# EAGLE schematic Unit C North Door TinkerAccess (EAGLE 9.7.0)
DRAWING_TITLE: Unit C North Door TinkerAccess

## Sheet 1 of 3
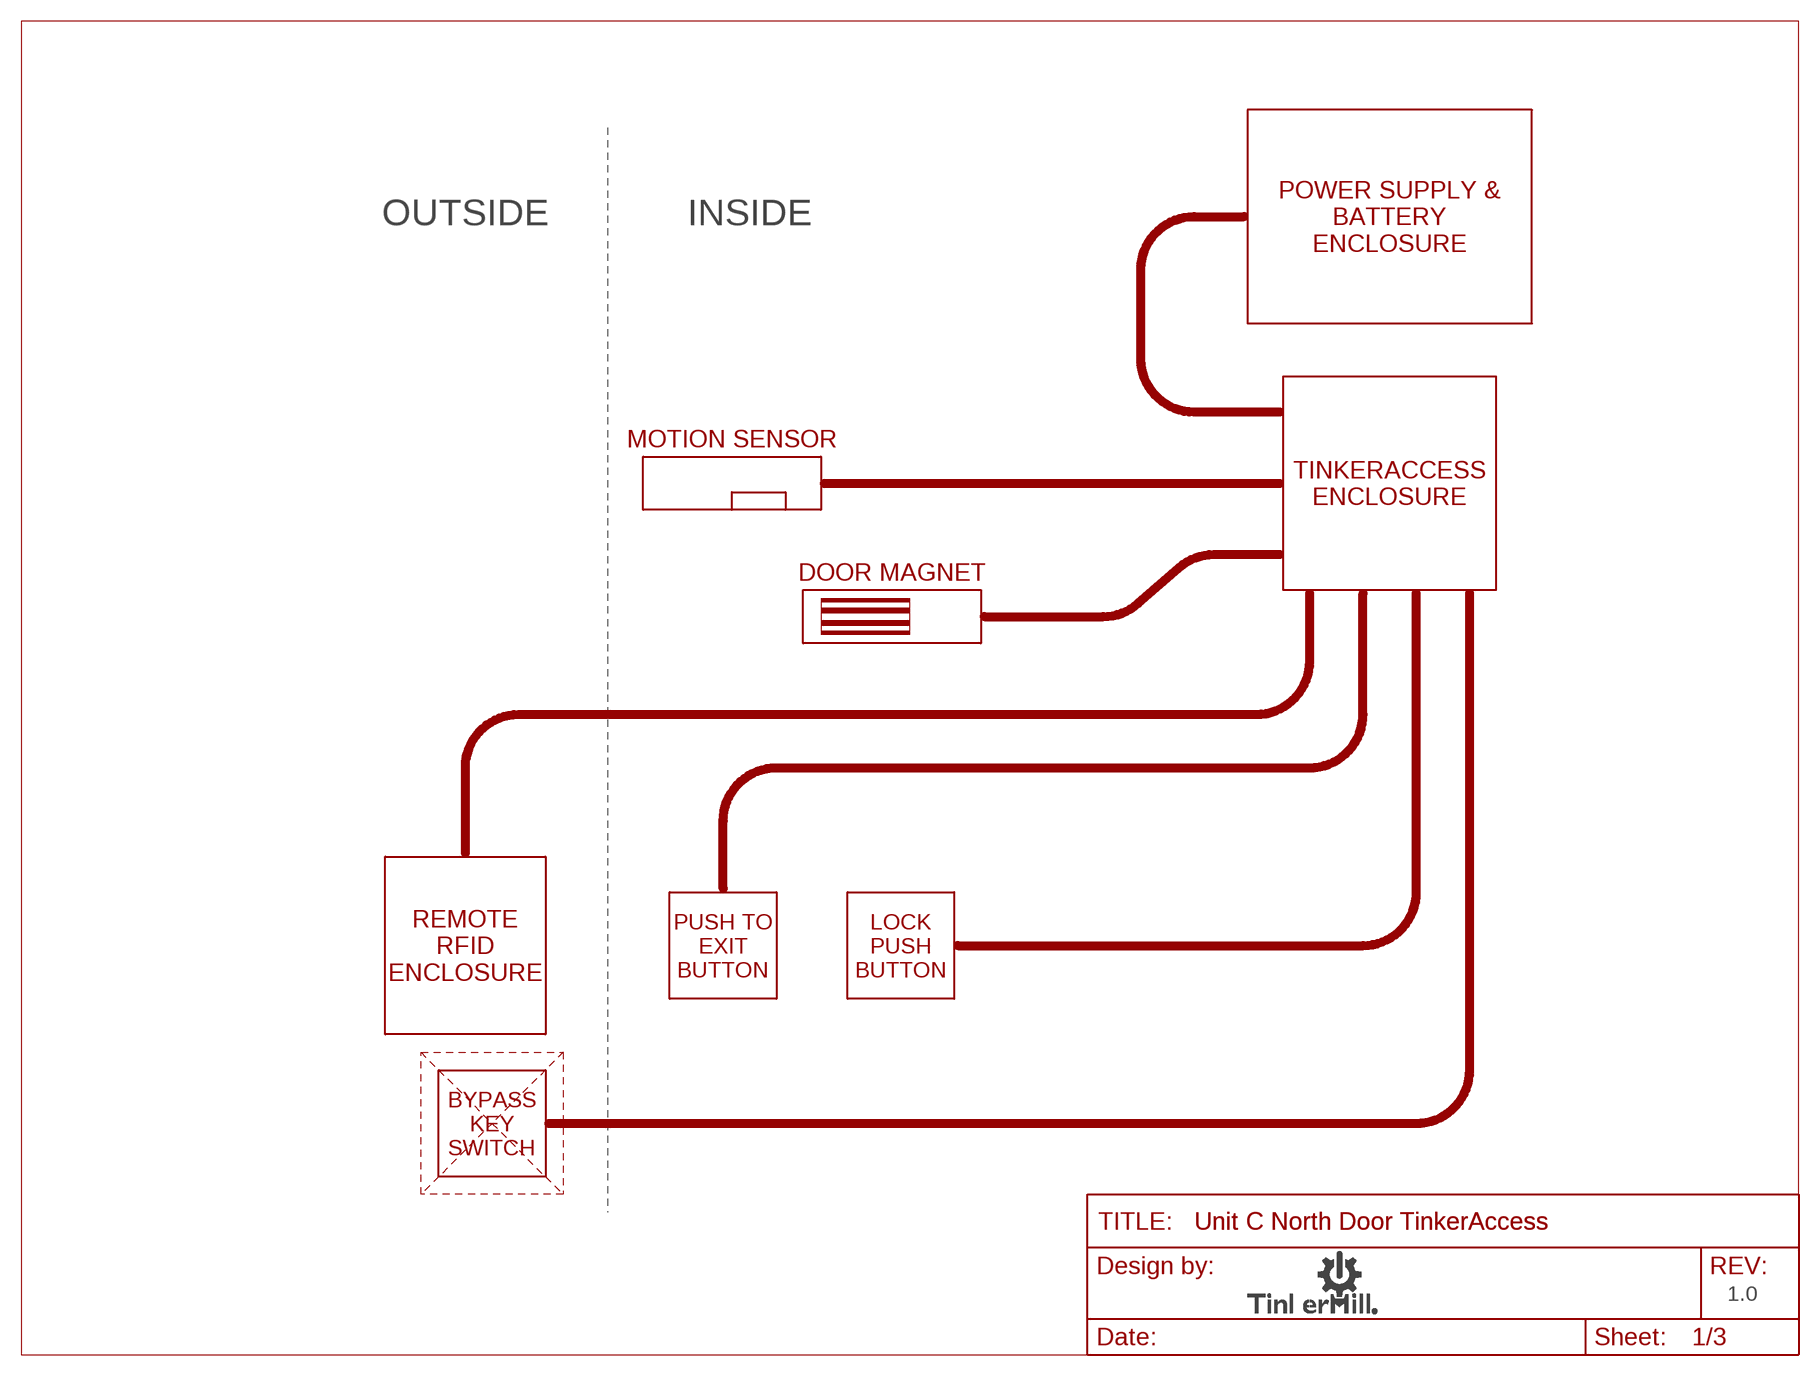
[diagram p0: schematic, sheet 1]

### Notes on the sheet
- OUTSIDE | INSIDE
- POWER SUPPLY &
  BATTERY
  ENCLOSURE
- MOTION SENSOR
- TINKERACCESS
  ENCLOSURE
- DOOR MAGNET
- REMOTE
  RFID
  ENCLOSURE
- PUSH TO
  EXIT
  BUTTON
- LOCK
  PUSH
  BUTTON
- BYPASS
  KEY
  SWITCH
- 1.0

## Sheet 2 of 3
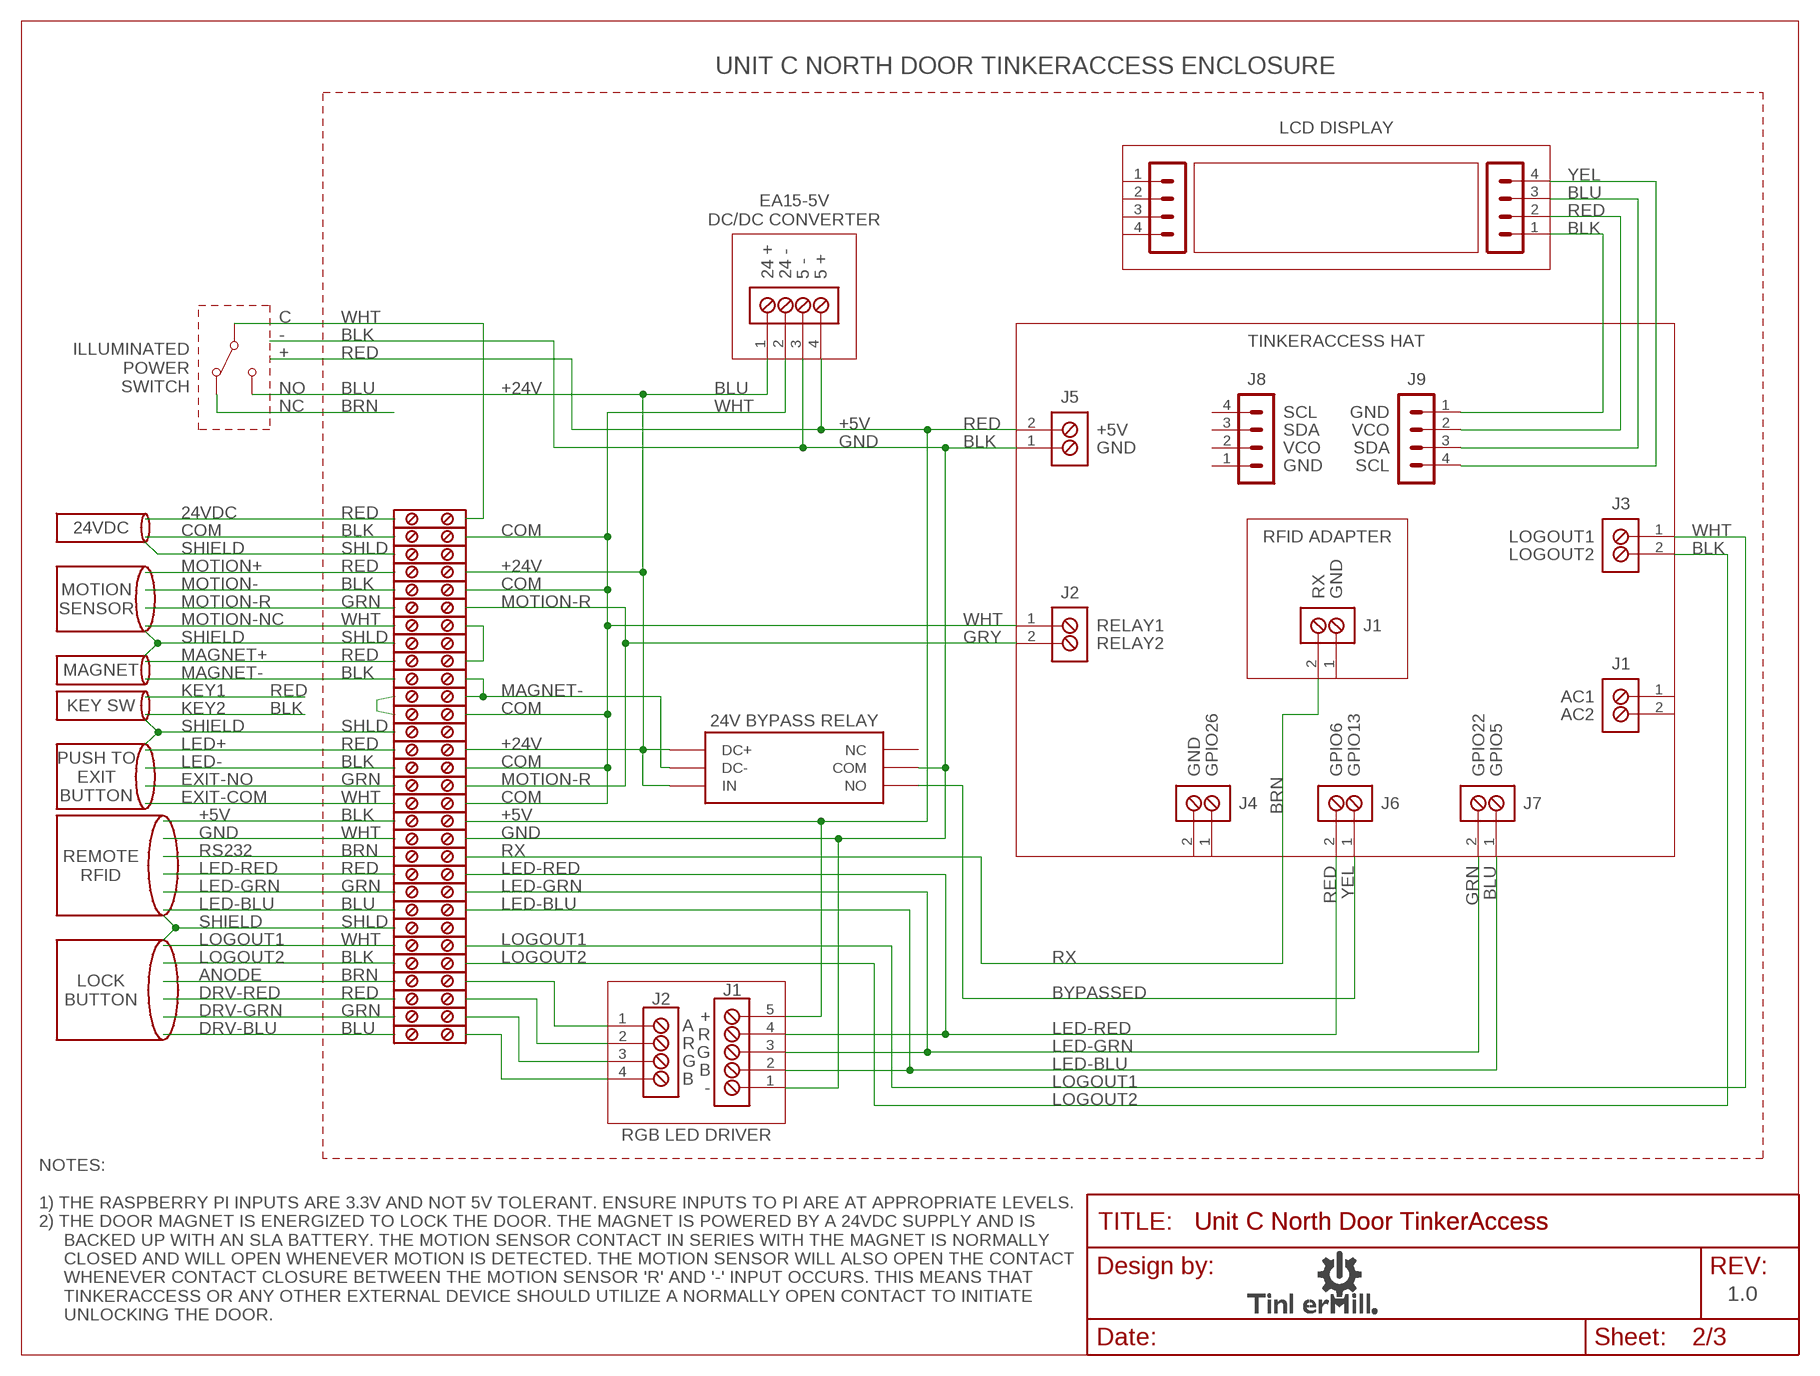
[diagram p1: schematic, sheet 2]

### Parts
BD1  24V BYPASS RELAY  RELAY_MODULE  (no package)
J1  TB_2X1_TE_CONN_ED555_2DS  [TE_CONN_ED555_2DS]
J2  TB_2X1_TE_CONN_ED555_2DS  [TE_CONN_ED555_2DS]
J3  TB_2X1_TE_CONN_ED555_2DS  [TE_CONN_ED555_2DS]
J4  TB_2X1_TE_CONN_ED555_2DS  [TE_CONN_ED555_2DS]
J5  TB_2X1_TE_CONN_ED555_2DS  [TE_CONN_ED555_2DS]
J6  TB_2X1_TE_CONN_ED555_2DS  [TE_CONN_ED555_2DS]
J7  TB_2X1_TE_CONN_ED555_2DS  [TE_CONN_ED555_2DS]
J8  HDR_4X1_2.54MM_LOCKING_RA  [HDR_4X1_2.54MM_LOCKING_RA]
J9  HDR_4X1_2.54MM_LOCKING_RA  [HDR_4X1_2.54MM_LOCKING_RA]
J10  HDR_4X1_2.54MM_LOCKING_RA  [HDR_4X1_2.54MM_LOCKING_RA]
J11  HDR_4X1_2.54MM_LOCKING_RA  [HDR_4X1_2.54MM_LOCKING_RA]
J12  J1  TB_2X1_TE_CONN_ED555_2DS  [TE_CONN_ED555_2DS]
J14  J2  TB_4X1_ON_SHORE_OSTVN04A150  [ON_SHORE_OSTVN04A150]
J15  J1  TB_5X1_ON_SHORE_OSTVN05A150  [ON_SHORE_OSTVN05A150]
J17  TB_4X1_TE_CONN_ED555_4DS  [TE_CONN_ED555_4DS]
SW1  TOGGLE_SWITCH_SPDT  (no package)
TB1  TERMINAL_BLOCK  (no package)
TB2  TERMINAL_BLOCK  (no package)
TB3  TERMINAL_BLOCK  (no package)
TB4  TERMINAL_BLOCK  (no package)
TB5  TERMINAL_BLOCK  (no package)
TB6  TERMINAL_BLOCK  (no package)
TB7  TERMINAL_BLOCK  (no package)
TB8  TERMINAL_BLOCK  (no package)
TB9  TERMINAL_BLOCK  (no package)
TB10  TERMINAL_BLOCK  (no package)
TB11  TERMINAL_BLOCK  (no package)
TB12  TERMINAL_BLOCK  (no package)
TB13  TERMINAL_BLOCK  (no package)
TB14  TERMINAL_BLOCK  (no package)
TB15  TERMINAL_BLOCK  (no package)
TB16  TERMINAL_BLOCK  (no package)
TB17  TERMINAL_BLOCK  (no package)
TB18  TERMINAL_BLOCK  (no package)
TB19  TERMINAL_BLOCK  (no package)
TB20  TERMINAL_BLOCK  (no package)
TB21  TERMINAL_BLOCK  (no package)
TB22  TERMINAL_BLOCK  (no package)
TB23  TERMINAL_BLOCK  (no package)
TB24  TERMINAL_BLOCK  (no package)
TB25  TERMINAL_BLOCK  (no package)
TB27  TERMINAL_BLOCK  (no package)
TB28  TERMINAL_BLOCK  (no package)
TB29  TERMINAL_BLOCK  (no package)
TB30  TERMINAL_BLOCK  (no package)
TB31  TERMINAL_BLOCK  (no package)

### Nets
24-BLK: TB31.A
24-RED: TB30.A
24-SHLD: TB25.A
+5V: J5.2 J15.5 J17.4 TB1.B
+24V: BD1.DC+ BD1.IN J17.1 SW1.NO TB12.B TB17.B
BUTTON-ANODE: J14.1 TB15.B
BUTTON-BLU: J14.4 TB22.B
BUTTON-GRN: J14.3 TB21.B
BUTTON-RED: J14.2 TB16.B
BYPASSED: BD1.NO J6.1
COM: J2.1 J17.2 TB10.B TB18.B TB24.B TB27.B TB31.B
DC+: SW1.C TB30.B
EXIT-BLK: TB10.A ; also sheet 3
EXIT-GRN: TB4.A ; also sheet 3
EXIT-RED: TB12.A ; also sheet 3
EXIT-WHT: TB24.A ; also sheet 3
GND: BD1.COM J5.1 J15.1 J17.3 TB2.B
KEY-EXIT-SHLD: TB23.A
LCD-GND: J9.1 J11.1
LCD-SCL: J9.4 J11.4
LCD-SDA: J9.3 J11.3
LCD-VCO: J9.2 J11.2
LED-BLU: J7.1 J15.2 TB7.B
LED-GRN: J7.2 J15.3 TB6.B
LED-RED: J6.2 J15.4 TB5.B
LOCK-BLK: TB8.A ; also sheet 3
LOCK-BLU: TB22.A ; also sheet 3
LOCK-GRN: TB21.A ; also sheet 3
LOCK-ORG: TB15.A ; also sheet 3
LOCK-RED: TB16.A ; also sheet 3
LOCK-WHT: TB9.A ; also sheet 3
LOGOUT1: J3.1 TB9.B ; also sheet 3
LOGOUT2: J3.2 TB8.B ; also sheet 3
MAGNET+: TB13.B TB20.B
MAGNET-: BD1.DC- TB14.B TB28.B
MAGNET-BLK: TB14.A ; also sheet 3
MAGNET-RED: TB13.A ; also sheet 3
MOTION-BLK: TB18.A ; also sheet 3
MOTION-GRN: TB19.A ; also sheet 3
MOTION-MAGNET-SHLD: TB29.A
MOTION-R: J2.2 TB4.B TB19.B
MOTION-RED: TB17.A ; also sheet 3
MOTION-WHT: TB20.A ; also sheet 3
N$2: SW1.NC
N$4: TB27.A TB28.A
REMOTE-BLK: TB1.A ; also sheet 3
REMOTE-BLU: TB7.A ; also sheet 3
REMOTE-BRN: TB3.A ; also sheet 3
REMOTE-GRN: TB6.A ; also sheet 3
REMOTE-LOCK-SHLD: TB11.A
REMOTE-RED: TB5.A ; also sheet 3
REMOTE-WHT: TB2.A ; also sheet 3
RX: J12.2 TB3.B
Unconnected: BD1.NC J1.1 J1.2 J4.1 J4.2 J8.1 J8.2 J8.3 J8.4 J10.1 J10.2 J10.3 J10.4 J12.1 TB11.B TB23.B TB25.B TB29.B

### Notes on the sheet
- UNIT C NORTH DOOR TINKERACCESS ENCLOSURE
- LCD DISPLAY
- YEL
- BLU
- RED
- EA15-5V
  DC/DC CONVERTER
- BLK
- 24 + | 24 - | 5 - | 5 +
- C | WHT
- - | BLK | TINKERACCESS HAT
- + | RED
- ILLUMINATED
  POWER
  SWITCH
- NO | BLU | BLU
- NC | BRN | WHT | SCL | GND
- RED | +5V | SDA | VCO
- BLK | GND | VCO | SDA
- GND | SCL
- 24VDC | RED
- 24VDC
- COM | BLK | RFID ADAPTER | LOGOUT1 | WHT
- SHIELD | SHLD | LOGOUT2 | BLK
- MOTION+ | RED
- MOTION- | BLK
- MOTION
  SENSOR
- RX | GND
- MOTION-R | GRN
- MOTION-NC | WHT | WHT | RELAY1
- SHIELD | SHLD | GRY | RELAY2
- MAGNET+ | RED
- MAGNET
- MAGNET- | BLK
- KEY1 | RED | AC1
- KEY SW
- KEY2 | BLK | AC2
- SHIELD | SHLD
- LED+ | RED
- LED- | BLK
- PUSH TO
  EXIT
  BUTTON
- GND | GPIO26 | BRN | GPIO6 | GPIO13 | GPIO22 | GPIO5
- EXIT-NO | GRN
- EXIT-COM | WHT
- +5V | BLK
- GND | WHT
- RS232 | BRN
- REMOTE
  RFID
- RED | YEL | GRN | BLU
- LED-RED | RED
- LED-GRN | GRN
- LED-BLU | BLU
- SHIELD | SHLD
- WHT
- BLK
- ANODE | BRN
- LOCK
  BUTTON
- DRV-RED | RED
- DRV-GRN | GRN | +
- A
- DRV-BLU | BLU | R
- R
- G
- G
- B
- B
- -
- RGB LED DRIVER
- NOTES:
  
  1) THE RASPBERRY PI INPUTS ARE 3.3V AND NOT 5V TOLERANT. ENSURE INPUTS TO PI ARE AT APPROPRIATE LEVELS.
  2) THE DOOR MAGNET IS ENERGIZED TO LOCK THE DOOR. THE MAGNET IS POWERED BY A 24VDC SUPPLY AND IS
       BACKED UP WITH AN SLA BATTERY. THE MOTION SENSOR CONTACT IN SERIES WITH THE MAGNET IS NORMALLY
       CLOSED AND WILL OPEN WHENEVER MOTION IS DETECTED. THE MOTION SENSOR WILL ALSO OPEN THE CONTACT
       WHENEVER CONTACT CLOSURE BETWEEN THE MOTION SENSOR 'R' AND '-' INPUT OCCURS. THIS MEANS THAT
       TINKERACCESS OR ANY OTHER EXTERNAL DEVICE SHOULD UTILIZE A NORMALLY OPEN CONTACT TO INITIATE
       UNLOCKING THE DOOR.
- 1.0

## Sheet 3 of 3
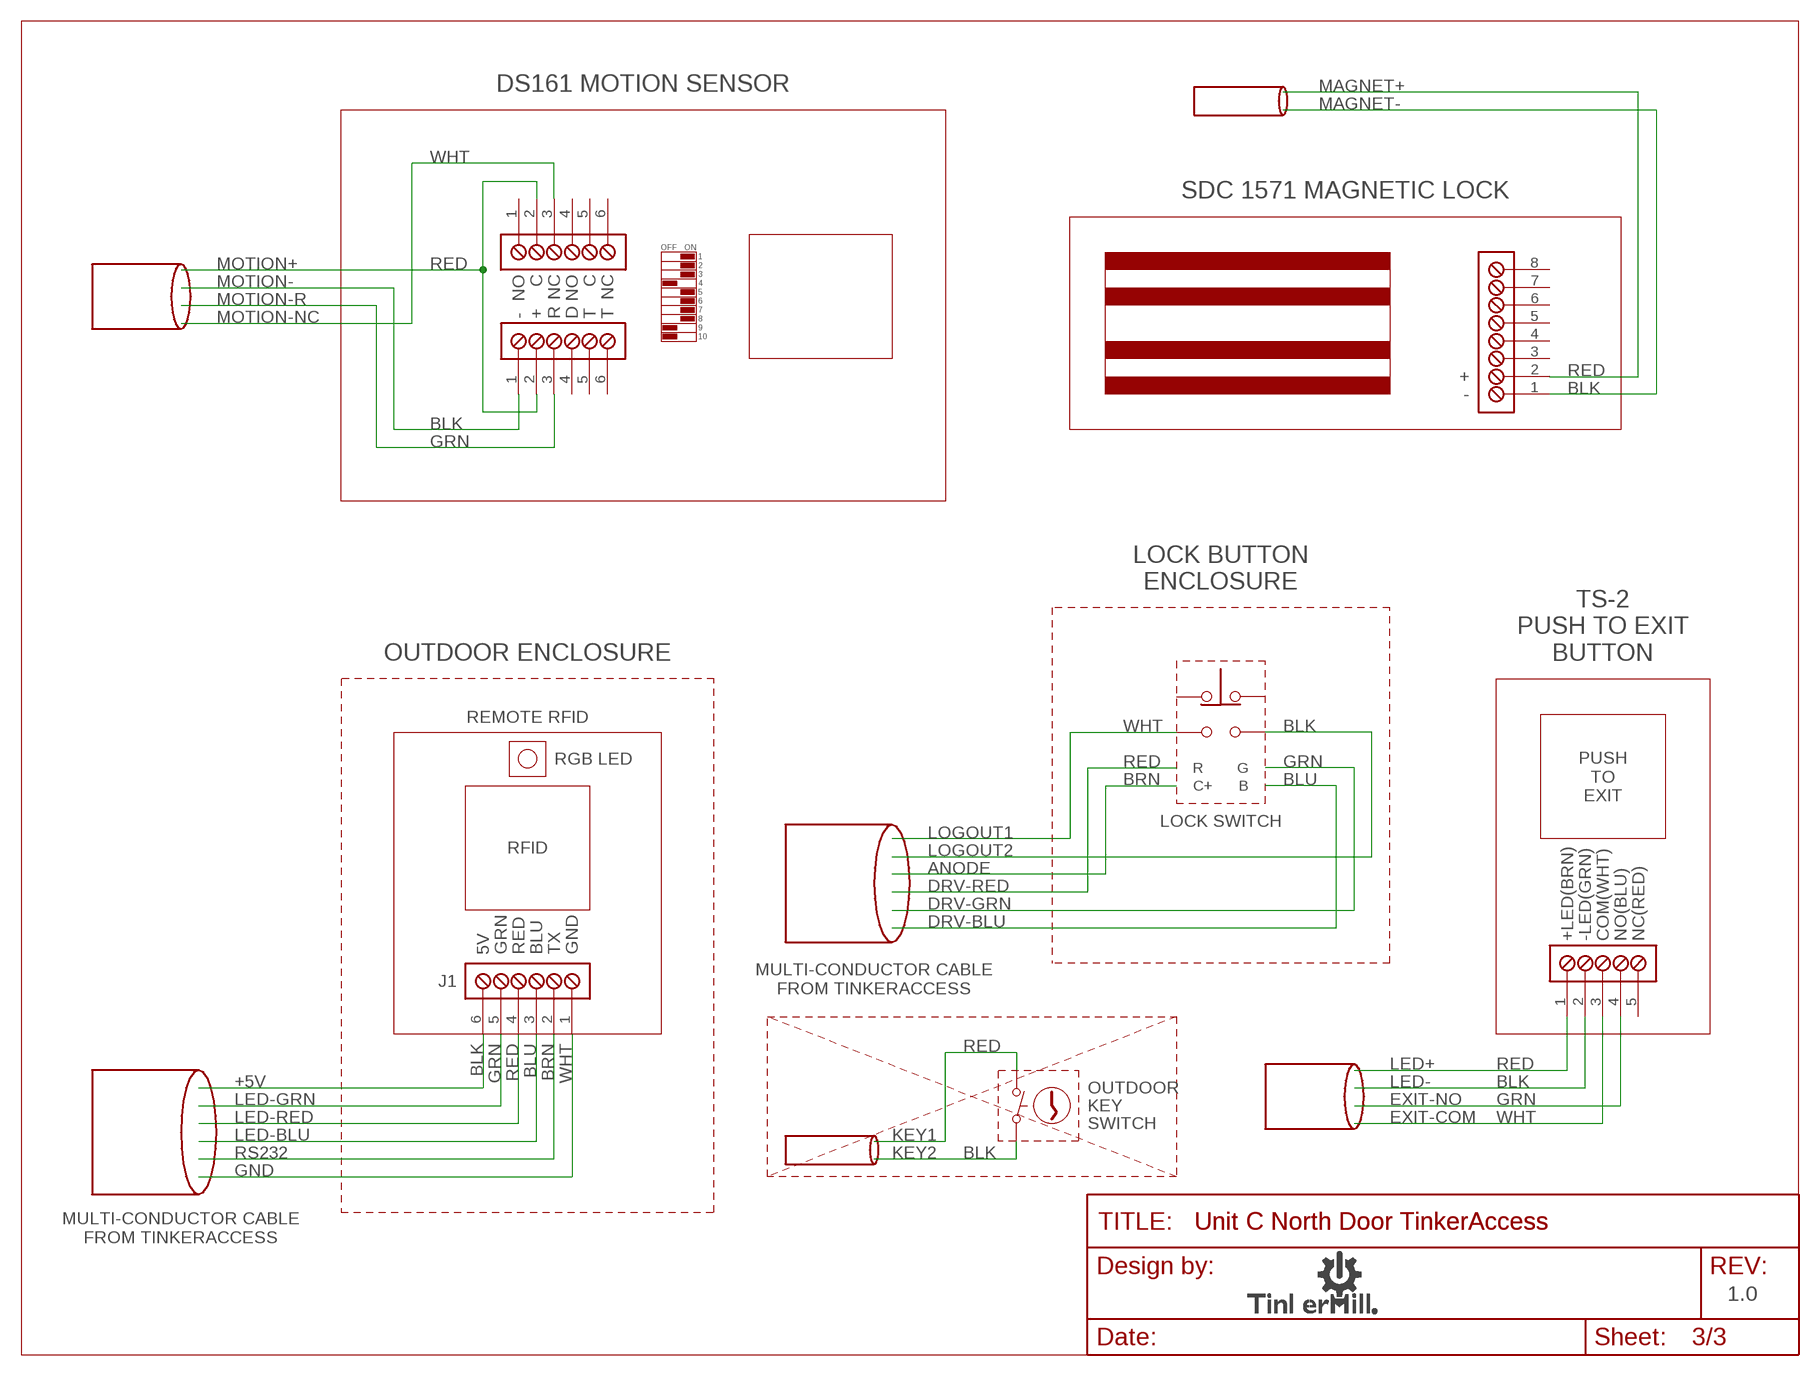
[diagram p2: schematic, sheet 3]

### Parts
J13  J1  TB_6X1_TE_CONN_ED555_6DS  [TE_CONN_ED555_6DS]
J16  TB_8X1_TE_CONN_ED555_8DS  [TE_CONN_ED555_8DS]
J18  TB_6X1_TE_CONN_ED555_6DS  [TE_CONN_ED555_6DS]
J19  TB_6X1_TE_CONN_ED555_6DS  [TE_CONN_ED555_6DS]
J21  TB_5X1_TE_CONN_ED555_5DS  [TE_CONN_ED555_5DS]
SW2  LOCK SWITCH  RGB_SWITCH  (no package)
SW3  OUTDOOR  KEYED_SWITCH  (no package)

### Nets
EXIT-BLK: J21.2 ; also sheet 2
EXIT-GRN: J21.4 ; also sheet 2
EXIT-RED: J21.1 ; also sheet 2
EXIT-WHT: J21.3 ; also sheet 2
KEY-BLK: SW3.2
KEY-RED: SW3.1
LOCK-BLK: SW2.4 ; also sheet 2
LOCK-BLU: SW2.B ; also sheet 2
LOCK-GRN: SW2.G ; also sheet 2
LOCK-ORG: SW2.C+ ; also sheet 2
LOCK-RED: SW2.R ; also sheet 2
LOCK-WHT: SW2.3 ; also sheet 2
MAGNET-BLK: J16.1 ; also sheet 2
MAGNET-RED: J16.2 ; also sheet 2
MOTION-BLK: J18.1 ; also sheet 2
MOTION-GRN: J18.3 ; also sheet 2
MOTION-RED: J18.2 J19.2 ; also sheet 2
MOTION-WHT: J19.3 ; also sheet 2
REMOTE-BLK: J13.6 ; also sheet 2
REMOTE-BLU: J13.3 ; also sheet 2
REMOTE-BRN: J13.2 ; also sheet 2
REMOTE-GRN: J13.5 ; also sheet 2
REMOTE-RED: J13.4 ; also sheet 2
REMOTE-WHT: J13.1 ; also sheet 2
Unconnected: J16.3 J16.4 J16.5 J16.6 J16.7 J16.8 J18.4 J18.5 J18.6 J19.1 J19.4 J19.5 J19.6 J21.5 SW2.1 SW2.2

### Notes on the sheet
- DS161 MOTION SENSOR | MAGNET+
- MAGNET-
- WHT
- SDC 1571 MAGNETIC LOCK
- OFF | ON
- 1
- 2
- MOTION+ | RED | NO | C | NC | NO | C | NC
- 3
- 4
- MOTION-
- 5
- 6
- MOTION-R
- 7
- MOTION-NC | - | + | R | D | T | T | 8
- 9
- 10
- + | RED
- - | BLK
- BLK
- GRN
- LOCK BUTTON
  ENCLOSURE
- OUTDOOR ENCLOSURE
- TS-2
  PUSH TO EXIT
  BUTTON
- REMOTE RFID
- WHT | BLK
- RGB LED
- RED | GRN
- PUSH
  TO
  EXIT
- BRN | BLU
- RFID
- ANODE
- DRV-RED
- DRV-GRN
- DRV-BLU
- +LED(BRN) | -LED(GRN) | COM(WHT) | NO(BLU) | NC(RED)
- 5V | GRN | RED | BLU | TX | GND
- MULTI-CONDUCTOR CABLE
  FROM TINKERACCESS
- BLK | GRN | RED | BLU | BRN | WHT
- RED
- LED+ | RED
- +5V | LED- | BLK
- LED-GRN | KEY | EXIT-NO | GRN
- LED-RED | SWITCH | EXIT-COM | WHT
- LED-BLU | KEY1
- RS232 | KEY2 | BLK
- GND
- MULTI-CONDUCTOR CABLE
  FROM TINKERACCESS
- 1.0

## Library data of the parts
BD1 = LTT Schematic Only:RELAY_MODULE
J1-J7 J12 = TMF_Connectors:TB_2X1
J8-J11 = TMF_Connectors:HDR_4X1
J13 J18 J19 = TMF_Connectors:TB_6X1
J14 J17 = TMF_Connectors:TB_4X1
J15 J21 = TMF_Connectors:TB_5X1
J16 = LTT Connectors:TB_8X1
SW1 = TMF_Schematic_Only:TOGGLE_SWITCH_SPDT
SW2 = TMF_Schematic_Only:RGB_SWITCH
SW3 = LTT Schematic Only:KEYED_SWITCH
TB1-TB25 TB27-TB31 = TMF_Schematic_Only:TERMINAL_BLOCK